# Altium schematic sheet Sheet1.SchDoc
size A4
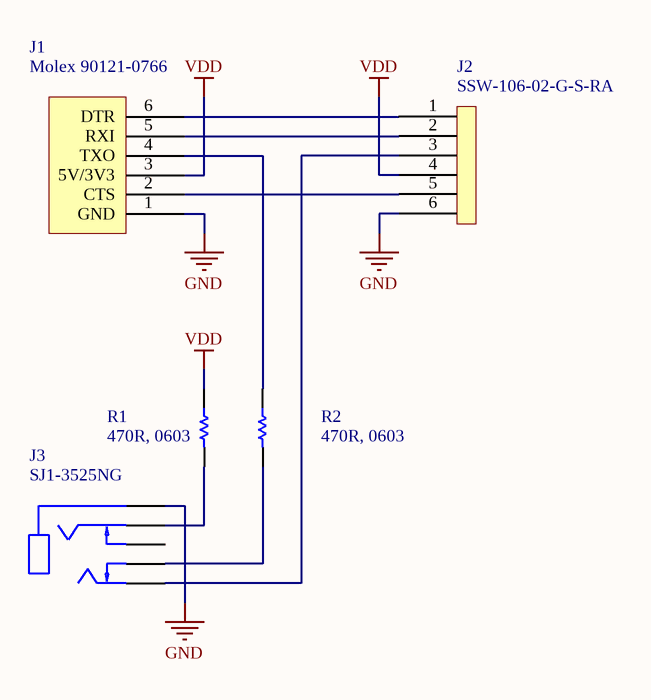
[diagram p0: Sheet1.SchDoc]

## Parts
J1  Molex 90121-0766  [FTDI Breakout with Molex 90121-0766]
J2  SSW-106-02-G-S-RA  [SSW-106-02-G-S-RA]
J3  SJ1-3525NG  [SJ1-3525NG]
R1  470R, 0603  [Resistor 0603]
R2  470R, 0603  [Resistor 0603]

## Nets
GND: J1.1(GND) J2.6 J3.1(sleeve)
VDD: J1.3(5V/3V3) J2.4 R1.2
NetJ1_2: J1.2(CTS) J2.5
NetJ1_4: J1.4(TXO) R2.2
NetJ1_5: J1.5(RXI) J2.2
NetJ1_6: J1.6(DTR) J2.1
NetJ2_3: J2.3 J3.2(tip)
NetJ3_3: J3.3(ring) R1.1
NetJ3_4: J3.4(tip_switch) R2.1

Not connected (* = marked no-connect by the designer): J3 5(ring_switch)

## Library data of the parts
J1 = FTDI Breakout
R1 R2 = Resistor